# EAGLE schematic Line Follower (EAGLE 9.6.2)
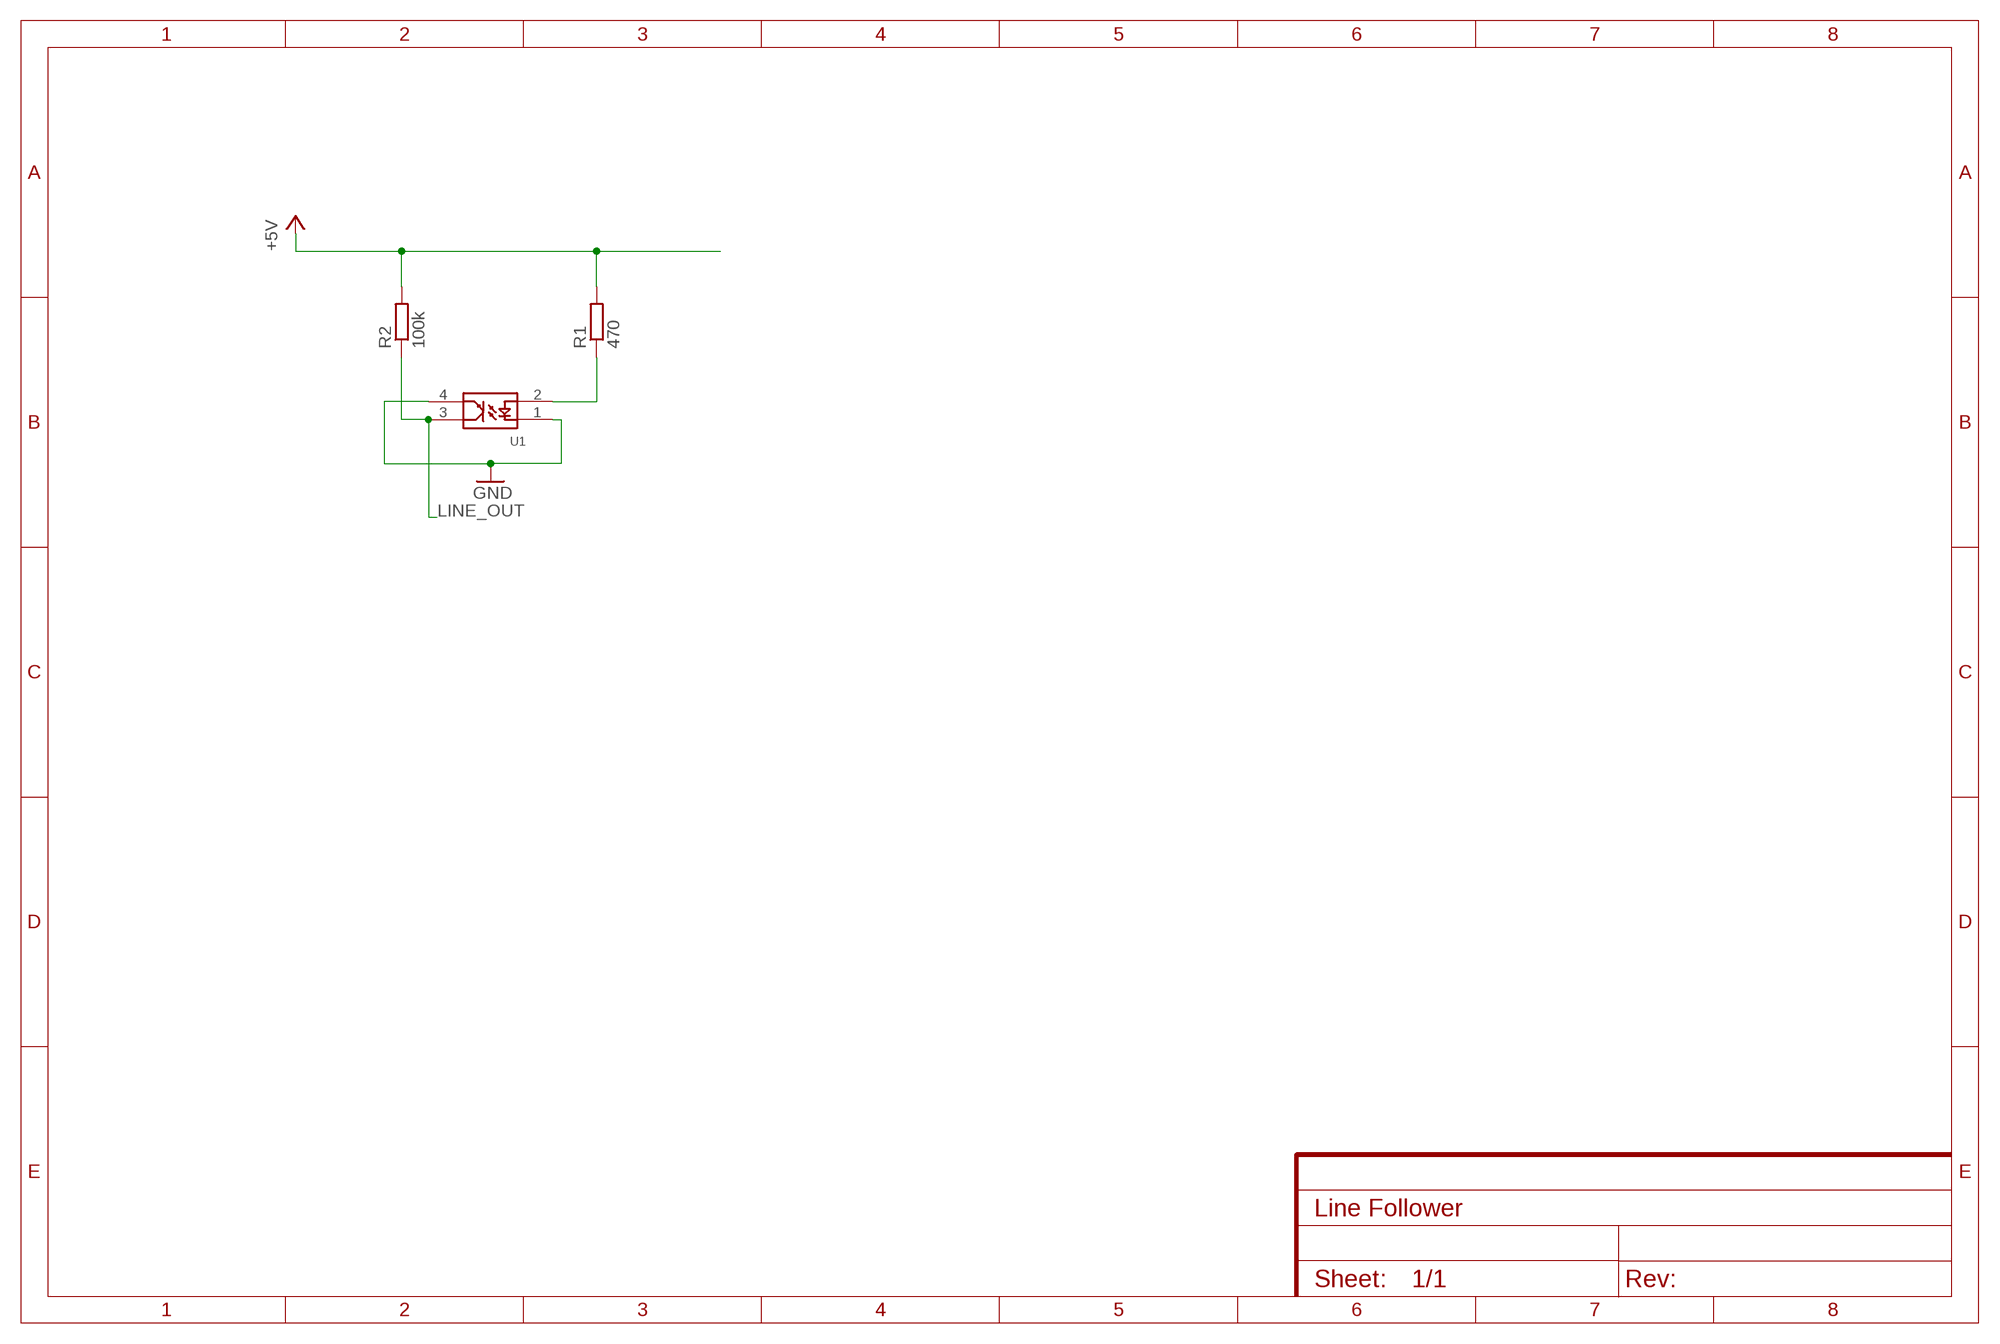
[diagram p0: schematic, sheet 1]

## Parts
R1  470  R-EU_0204/7  [0204/7]
R2  100k  R-EU_0204/7  [0204/7]
U1  OPB704  [22-23-2041]

## Nets
+5V: R1.2 R2.2
GND: U1.1 U1.4
LINE_OUT: R2.1 U1.3
N$1: R1.1 U1.2

## Library data of the parts
R1 R2 = IDP_library:R-EU_: RESISTOR, European symbol; SPICEPREFIX: R
U1 = IDP_library:OPB704: 314020022